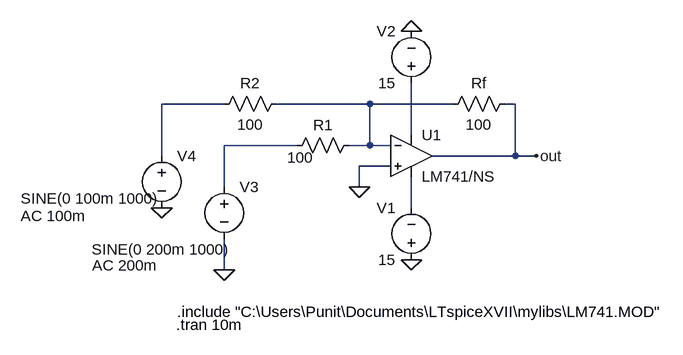
[diagram p0: schematic summing_2_inputs.asc]
summing_2_inputs.asc, the LTspice schematic file:
Version 4
SHEET 1 880 680
WIRE -144 16 -240 16
WIRE 80 16 -64 16
WIRE 208 16 80 16
WIRE 304 16 288 16
WIRE 144 64 144 -16
WIRE -32 80 -144 80
WIRE 80 80 80 16
WIRE 80 80 48 80
WIRE 112 80 80 80
WIRE -240 96 -240 16
WIRE 304 96 304 16
WIRE 304 96 176 96
WIRE 336 96 304 96
WIRE 112 112 64 112
WIRE -144 144 -144 80
WIRE 64 144 64 112
WIRE 144 176 144 128
WIRE -144 272 -144 224
FLAG 144 256 0
FLAG 144 -96 0
FLAG 336 96 out
FLAG 64 144 0
FLAG -144 272 0
FLAG -240 176 0
SYMBOL OpAmps\\opamp2 144 32 R0
SYMATTR InstName U1
SYMATTR Value LM741/NS
SYMBOL voltage 144 272 R180
WINDOW 0 24 96 Left 2
WINDOW 3 24 16 Left 2
WINDOW 123 0 0 Left 0
WINDOW 39 0 0 Left 0
SYMATTR InstName V1
SYMATTR Value 15
SYMBOL voltage 144 0 R180
WINDOW 0 24 96 Left 2
WINDOW 3 24 16 Left 2
WINDOW 123 0 0 Left 0
WINDOW 39 0 0 Left 0
SYMATTR InstName V2
SYMATTR Value 15
SYMBOL voltage -144 128 R0
WINDOW 3 -204 112 Left 2
WINDOW 123 -203 137 Left 2
WINDOW 39 0 0 Left 0
SYMATTR InstName V3
SYMATTR Value SINE(0 200m 1000)
SYMATTR Value2 AC 200m
SYMBOL res 64 64 R90
WINDOW 0 0 56 VBottom 2
WINDOW 3 19 91 VTop 2
SYMATTR InstName R1
SYMATTR Value 100
SYMBOL res 304 0 R90
WINDOW 0 0 56 VBottom 2
WINDOW 3 32 56 VTop 2
SYMATTR InstName Rf
SYMATTR Value 100
SYMBOL voltage -240 80 R0
WINDOW 3 -217 82 Left 2
WINDOW 123 -217 109 Left 2
WINDOW 39 0 0 Left 0
SYMATTR InstName V4
SYMATTR Value SINE(0 100m 1000)
SYMATTR Value2 AC 100m
SYMBOL res -48 0 R90
WINDOW 0 0 56 VBottom 2
WINDOW 3 32 56 VTop 2
SYMATTR InstName R2
SYMATTR Value 100
TEXT -216 336 Left 2 !.include "C:\\Users\\Punit\\Documents\\LTspiceXVII\\mylibs\\LM741.MOD"
TEXT -218 356 Left 2 !.tran 10m

The netlist it stands for:
* summing_2_inputs.asc
XU1 0 N002 N003 N005 out LM741/NS  ; pins In+ In- V+ V- OUT
V1 0 N005 15
V2 N003 0 15
V3 N004 0 SINE(0 200m 1000) AC 200m
R1 N002 N004 100
Rf out N002 100
V4 N001 0 SINE(0 100m 1000) AC 100m
R2 N002 N001 100
.include "C:\Users\Punit\Documents\LTspiceXVII\mylibs\LM741.MOD"
.tran 10m
.backanno
.end